# Altium schematic sheet Integrators.SchDoc: FIT_PM12 board
size 420 x 297 mm; CheckedBy: G.Kasprowicz; Author: INR Moscow; CompanyName: WUT ISE; DrawnBy: M.Podgórski; Organization: WUT ISE; Address1: PW ISE; Address2: Nowowiejska 15/19 00-665 Warsaw; Address3: gkasprow@gmail.com; DocumentNumber: 3; Revision: 2; SheetNumber: 5; SheetTotal: 21; ModifiedBy: -; CheckedDate: -; Title2: Integrators; DivGrp: WUT ISE; Designer: INR RAS; ModifiedDate: -; ProjectName: Sensor Box
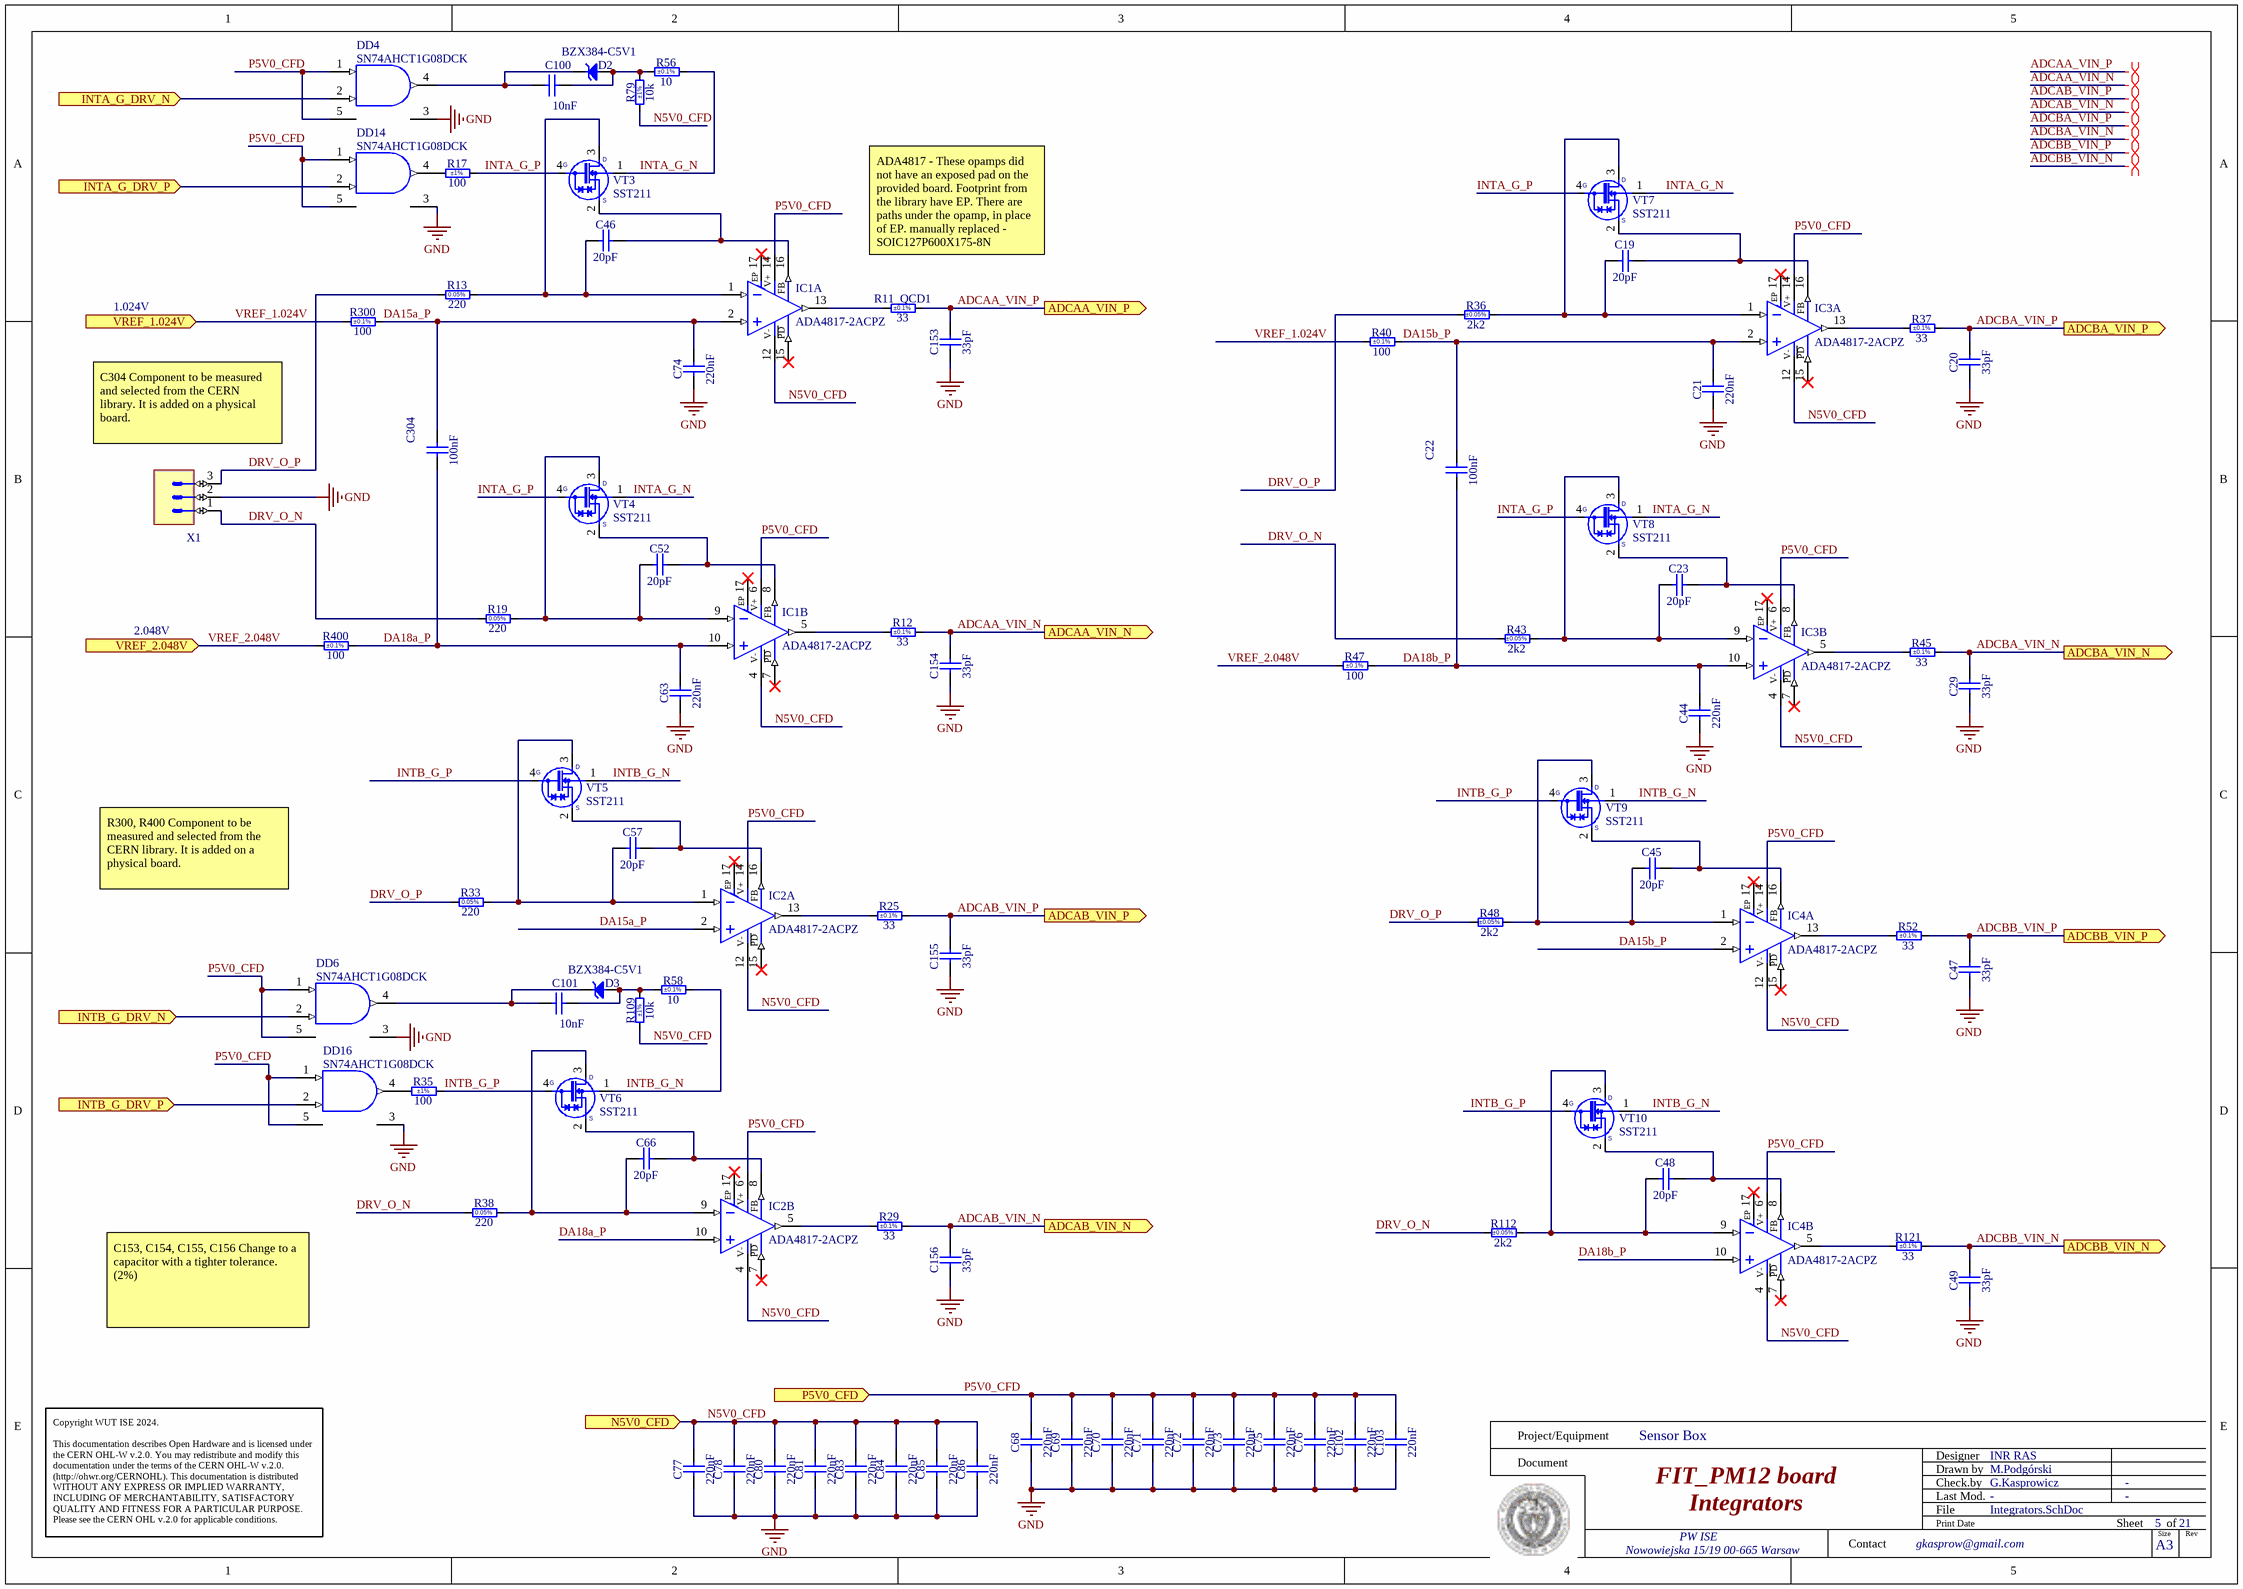
[diagram p0: Integrators.SchDoc]

## Parts
C19  20pF  [CAPC2012X135N]
C20  33pF  [CAPC1608X87N]
C21  220nF  [CAPC1005X55N]
C22  100nF  [CAPC2012X88N]
C23  20pF  [CAPC2012X135N]
C29  33pF  [CAPC1608X87N]
C44  220nF  [CAPC1005X55N]
C45  20pF  [CAPC2012X135N]
C46  20pF  [CAPC2012X135N]
C47  33pF  [CAPC1608X87N]
C48  20pF  [CAPC2012X135N]
C49  33pF  [CAPC1608X87N]
C52  20pF  [CAPC2012X135N]
C57  20pF  [CAPC2012X135N]
C63  220nF  [CAPC1005X55N]
C66  20pF  [CAPC2012X135N]
C68  220nF  [CAPC1005X55N]
C69  220nF  [CAPC1005X55N]
C70  220nF  [CAPC1005X55N]
C71  220nF  [CAPC1005X55N]
C72  220nF  [CAPC1005X55N]
C73  220nF  [CAPC1005X55N]
C74  220nF  [CAPC1005X55N]
C75  220nF  [CAPC1005X55N]
C76  220nF  [CAPC1005X55N]
C77  220nF  [CAPC1005X55N]
C78  220nF  [CAPC1005X55N]
C80  220nF  [CAPC1005X55N]
C81  220nF  [CAPC1005X55N]
C83  220nF  [CAPC1005X55N]
C84  220nF  [CAPC1005X55N]
C85  220nF  [CAPC1005X55N]
C86  220nF  [CAPC1005X55N]
C100  10nF  [CAPC1005X55N]
C101  10nF  [CAPC1005X55N]
C102  220nF  [CAPC1005X55N]
C103  220nF  [CAPC1005X55N]
C153  33pF  [CAPC1608X87N]
C154  33pF  [CAPC1608X87N]
C155  33pF  [CAPC1608X87N]
C156  33pF  [CAPC1608X87N]
C304  100nF  [CAPC2012X88N]
D2  BZX384-C5V1  [SOD2512X110N]
D3  BZX384-C5V1  [SOD2512X110N]
DD4  SN74AHCT1G08DCK  [SOT65P210X110-5N]
DD6  SN74AHCT1G08DCK  [SOT65P210X110-5N]
DD14  SN74AHCT1G08DCK  [SOT65P210X110-5N]
DD16  SN74AHCT1G08DCK  [SOT65P210X110-5N]
IC1  ADA4817-2ACPZ  [QFN65P400X400X80-17N-S240]  (parts A,B of 2)
IC2  ADA4817-2ACPZ  [QFN65P400X400X80-17N-S240]  (parts A,B of 2)
IC3  ADA4817-2ACPZ  [QFN65P400X400X80-17N-S240]  (parts A,B of 2)
IC4  ADA4817-2ACPZ  [QFN65P400X400X80-17N-S240]  (parts A,B of 2)
R11_QCD1  33  Tolerance: ±0.1%  [RESC1608X64N]
R12  33  Tolerance: ±0.1%  [RESC1608X64N]
R13  220  [RESC2012X60N]
R17  100  Tolerance: ±1%  [RESC1608X55N]
R19  220  [RESC2012X60N]
R25  33  Tolerance: ±0.1%  [RESC1608X64N]
R29  33  Tolerance: ±0.1%  [RESC1608X64N]
R33  220  [RESC2012X60N]
R35  100  Tolerance: ±1%  [RESC1608X55N]
R36  2k2  Tolerance: ±0.05%  [RESC2012X60N]
R37  33  Tolerance: ±0.1%  [RESC1608X64N]
R38  220  [RESC2012X60N]
R40  100  Tolerance: ±0.1%  [RES_VISHAY_FCHP0402]
R43  2k2  Tolerance: ±0.05%  [RESC2012X60N]
R45  33  Tolerance: ±0.1%  [RESC1608X64N]
R47  100  Tolerance: ±0.1%  [RES_VISHAY_FCHP0402]
R48  2k2  Tolerance: ±0.05%  [RESC2012X60N]
R52  33  Tolerance: ±0.1%  [RESC1608X64N]
R56  10  Tolerance: ±0.1%  [RESC2012X60N]
R58  10  Tolerance: ±0.1%  [RESC2012X60N]
R79  10k  Tolerance: ±1%  [RESC1608X55N]
R109  10k  Tolerance: ±1%  [RESC1608X55N]
R112  2k2  Tolerance: ±0.05%  [RESC2012X60N]
R121  33  Tolerance: ±0.1%  [RESC1608X64N]
R300  100  Tolerance: ±0.1%  [RES_VISHAY_FCHP0402]
R400  100  Tolerance: ±0.1%  [RES_VISHAY_FCHP0402]
VT3  SST211  [SOT143N]
VT4  SST211  [SOT143N]
VT5  SST211  [SOT143N]
VT6  SST211  [SOT143N]
VT7  SST211  [SOT143N]
VT8  SST211  [SOT143N]
VT9  SST211  [SOT143N]
VT10  SST211  [SOT143N]
X1  Header 3  [SAMTEC_DW-03-09-L-S-470]  (value not drawn)

## Ports
ADCAA_VIN_N (out), ADCAA_VIN_P (out), ADCAB_VIN_N (out), ADCAB_VIN_P (out), ADCBA_VIN_N (out), ADCBA_VIN_P (out), ADCBB_VIN_N (out), ADCBB_VIN_P (out), INTA_G_DRV_N (in), INTA_G_DRV_P (in), INTB_G_DRV_N (in), INTB_G_DRV_P (in), N5V0_CFD (in), P5V0_CFD (in), VREF_1.024V (in), VREF_2.048V (in)

## Nets
GND: C20.1 C21.1 C29.1 C44.1 C47.1 C49.1 C63.1 C68.1 C69.1 C70.1 C71.1 C72.1 C73.1 C74.1 C75.1 C76.1 C77.1 C78.1 C80.1 C81.1 C83.1 C84.1 C85.1 C86.1 C102.1 C103.1 C153.1 C154.1 C155.1 C156.1 DD4.3(GND) DD6.3(GND) DD14.3(GND) DD16.3(GND) X1.2
ADCAA_VIN_N: C154.2 R12.2 ; port ADCAA_VIN_N
ADCAA_VIN_P: C153.2 R11_QCD1.2 ; port ADCAA_VIN_P
ADCAB_VIN_N: C156.2 R29.2 ; port ADCAB_VIN_N
ADCAB_VIN_P: C155.2 R25.2 ; port ADCAB_VIN_P
ADCBA_VIN_N: C29.2 R45.2 ; port ADCBA_VIN_N
ADCBA_VIN_P: C20.2 R37.2 ; port ADCBA_VIN_P
ADCBB_VIN_N: C49.2 R121.2 ; port ADCBB_VIN_N
ADCBB_VIN_P: C47.2 R52.2 ; port ADCBB_VIN_P
DA15a_P: C74.2 C304.2 IC1.2(IN+) IC2.2(IN+) R300.1
DA15b_P: C21.2 C22.2 IC3.2(IN+) IC4.2(IN+) R40.1
DA18a_P: C63.2 C304.1 IC1.10(IN+) IC2.10(IN+) R400.1
DA18b_P: C22.1 C44.2 IC3.10(IN+) IC4.10(IN+) R47.1
DRV_O_N: R19.1 R38.1 R43.1 R112.1 X1.1
DRV_O_P: R13.1 R33.1 R36.1 R48.1 X1.3
INTA_G_DRV_N: DD4.2(A) ; port INTA_G_DRV_N
INTA_G_DRV_P: DD14.2(A) ; port INTA_G_DRV_P
INTA_G_N: R56.1 VT3.1(SUB) VT4.1(SUB) VT7.1(SUB) VT8.1(SUB)
INTA_G_P: R17.2 VT3.4(G) VT4.4(G) VT7.4(G) VT8.4(G)
INTB_G_DRV_N: DD6.2(A) ; port INTB_G_DRV_N
INTB_G_DRV_P: DD16.2(A) ; port INTB_G_DRV_P
INTB_G_N: R58.1 VT5.1(SUB) VT6.1(SUB) VT9.1(SUB) VT10.1(SUB)
INTB_G_P: R35.2 VT5.4(G) VT6.4(G) VT9.4(G) VT10.4(G)
N5V0_CFD: C77.2 C78.2 C80.2 C81.2 C83.2 C84.2 C85.2 C86.2 IC1.4(-Vs) IC1.12(-Vs) IC2.4(-Vs) IC2.12(-Vs) IC3.4(-Vs) IC3.12(-Vs) IC4.4(-Vs) IC4.12(-Vs) R79.1 R109.1 ; port N5V0_CFD
P5V0_CFD: C68.2 C69.2 C70.2 C71.2 C72.2 C73.2 C75.2 C76.2 C102.2 C103.2 DD4.1(B) DD4.5(VCC) DD6.1(B) DD6.5(VCC) DD14.1(B) DD14.5(VCC) DD16.1(B) DD16.5(VCC) IC1.6(+Vs) IC1.14(+Vs) IC2.6(+Vs) IC2.14(+Vs) IC3.6(+Vs) IC3.14(+Vs) IC4.6(+Vs) IC4.14(+Vs) ; port P5V0_CFD
VREF_1.024V: R40.2 R300.2 ; port VREF_1.024V
VREF_2.048V: R47.2 R400.2 ; port VREF_2.048V
NetC19_1: C19.1 IC3.1(IN-) R36.2 VT7.3(D)
NetC19_2: C19.2 IC3.16(FB) VT7.2(S)
NetC23_1: C23.1 IC3.9(IN-) R43.2 VT8.3(D)
NetC23_2: C23.2 IC3.8(FB) VT8.2(S)
NetC45_1: C45.1 IC4.1(IN-) R48.2 VT9.3(D)
NetC45_2: C45.2 IC4.16(FB) VT9.2(S)
NetC46_1: C46.1 IC1.1(IN-) R13.2 VT3.3(D)
NetC46_2: C46.2 IC1.16(FB) VT3.2(S)
NetC48_1: C48.1 IC4.9(IN-) R112.2 VT10.3(D)
NetC48_2: C48.2 IC4.8(FB) VT10.2(S)
NetC52_1: C52.1 IC1.9(IN-) R19.2 VT4.3(D)
NetC52_2: C52.2 IC1.8(FB) VT4.2(S)
NetC57_1: C57.1 IC2.1(IN-) R33.2 VT5.3(D)
NetC57_2: C57.2 IC2.16(FB) VT5.2(S)
NetC66_1: C66.1 IC2.9(IN-) R38.2 VT6.3(D)
NetC66_2: C66.2 IC2.8(FB) VT6.2(S)
NetC100_1: C100.1 D2.2(A) R56.2 R79.2
NetC100_2: C100.2 D2.1(C) DD4.4(Y)
NetC101_1: C101.1 D3.2(A) R58.2 R109.2
NetC101_2: C101.2 D3.1(C) DD6.4(Y)
NetDD14_4: DD14.4(Y) R17.1
NetDD16_4: DD16.4(Y) R35.1
NetIC1_5: IC1.5(OUT) R12.1
NetIC1_13: IC1.13(OUT) R11_QCD1.1
NetIC2_5: IC2.5(OUT) R29.1
NetIC2_13: IC2.13(OUT) R25.1
NetIC3_5: IC3.5(OUT) R45.1
NetIC3_13: IC3.13(OUT) R37.1
NetIC4_5: IC4.5(OUT) R121.1
NetIC4_13: IC4.13(OUT) R52.1

Not connected (* = marked no-connect by the designer): IC1 7(~{PD})* 15(~{PD})* 17(EP)*; IC2 7(~{PD})* 15(~{PD})* 17(EP)*; IC3 7(~{PD})* 15(~{PD})* 17(EP)*; IC4 7(~{PD})* 15(~{PD})* 17(EP)*

## Layout directives
differential pair; differential pair class D100: ADCAA_VIN_N, ADCAA_VIN_P, ADCAB_VIN_N, ADCAB_VIN_P, ADCBA_VIN_N, ADCBA_VIN_P, ADCBB_VIN_N, ADCBB_VIN_P

## Notes on the sheet
- ADA4817 - These opamps did not have an exposed pad on the provided board. Footprint from the library have EP. There are paths under the opamp, in place of EP. manually replaced - SOIC127P600X175-8N
- 1.024V
- (near X1) C304 Component to be measured and selected from the CERN library. It is added on a physical board.
- 2.048V
- R300, R400 Component to be measured and selected from the CERN library. It is added on a physical board.
- C153, C154, C155, C156 Change to a capacitor with a tighter tolerance. (2%)
- Project/Equipment
- Document
- Designer
- Drawn by
- Check.by
- Copyright WUT ISE 2024.
  This documentation describes Open Hardware and is licensed under the CERN OHL-W v.2.0. You may redistribute and modify this documentation under the terms of the CERN OHL-W v.2.0. (http://ohwr.org/CERNOHL). This documentation is distributed WITHOUT ANY EXPRESS OR IMPLIED WARRANTY, INCLUDING OF MERCHANTABILITY, SATISFACTORY QUALITY AND FITNESS FOR A PARTICULAR PURPOSE. Please see the CERN OHL v.2.0 for applicable conditions.
- Contact
- File
- Last Mod.
- Print Date
- Sheet
- Size
- A3
- of
- Rev
- (in symbol ADA4817-2ACPZ, part A) V+; V-; PD
- (in symbol ADA4817-2ACPZ, part B) V+; V-; PD
- (in symbol R0805_220R_0.05%_0.125W_10PPM) 0.05%

## Library data of the parts
C19 C23 C45 C46 C48 C52 C57 C66 = CC0805_20PF_50V_2%_C0G: Non-polarised capacitor; Part Description: SMD Multilayer Chip Ceramic Capacitor; Manufacturer: GENERIC; Manufacturer1 Part Number: CC0805GRNPO9BN200; Voltage: 50V; TC: C0G/NP0; Tolerance: ±2%; Part Number: CC0805_20PF_50V_2%_C0G; Component Kind: Standard; Component Type: Standard; Pin Count: 2; Value: 20pF; Status: None; Manufacturer Part Number: CC0805_20PF_50V_2%_C0G; Case: 0805; Mounted: Yes; Socket: No; SMD: Yes; Sense: No; Manufacturer1 Example: YAGEO PHYCOMP; Manufacturer1 ComponentHeight: 1.45mm; HelpURL: \\cern.ch\dfs\Applications\Altium\Datasheets\CC0805_NP0_YAGEO.pdf; Author: CERN DEM HF; CreateDate: 07.05.2024; LatestRevisionDate: 07.05.2024
C20 C29 C47 C49 C153-C156 = CC0603_33PF_50V_5%_NP0: Non-polarised capacitor; Part Description: SMD Multilayer Chip Ceramic Capacitor; Manufacturer: GENERIC; Manufacturer1 Part Number: 223886715339; Voltage: 50V; TC: C0G/NP0; Tolerance: ±5%; Part Number: CC0603_33PF_50V_5%_NP0; Component Kind: Standard; Component Type: Standard; Pin Count: 2; Value: 33pF; Status: Preferred; Manufacturer Part Number: CC0603_33PF_50V_5%_NP0; Case: 0603; Mounted: Yes; Socket: No; SMD: Yes; Sense: No; Manufacturer1 Example: PHYCOMP; Manufacturer1 ComponentHeight: 0.87mm; HelpURL: \\cern.ch\dfs\Applications\Altium\Datasheets\CC0603_NP0_PHYCOMP.pdf; Author: CERN DEM JLC; CreateDate: 03.12.2007; LatestRevisionDate: 03.12.2007
C21 C44 C63 C68-C78 C80 C81 C83-C86 C102 C103 = CC0402_220NF_16V_10%_X7R: Non-polarised capacitor; Part Description: SMD Multilayer Chip Ceramic Capacitor; Manufacturer: GENERIC; Manufacturer1 Part Number: C1005X7R1C224K050; Voltage: 16V; TC: X7R; Tolerance: ±10%; Part Number: CC0402_220NF_16V_10%_X7R; Component Kind: Standard; Component Type: Standard; Pin Count: 2; Value: 220nF; Status: Preferred; Manufacturer Part Number: CC0402_220NF_16V_10%_X7R; Case: 0402; Mounted: Yes; Socket: No; SMD: Yes; Sense: No; Manufacturer1 Example: TDK; Manufacturer1 ComponentHeight: 0.55mm; HelpURL: \\cern.ch\dfs\Applications\Altium\Datasheets\CC0402_X7R_TDK_C.pdf; Author: CERN DEM JLC; CreateDate: 25.10.2012; LatestRevisionDate: 25.10.2012
C22 C304 = CC0805_100NF_50V_1%_NP0: Non-polarised capacitor; Part Description: SMD Multilayer Chip Ceramic Capacitor; Manufacturer: GENERIC; Manufacturer1 Part Number: 0805N103F500C; Voltage: 50V; TC: C0G/NP0; Tolerance: ±1%; Part Number: CC0805_100NF_50V_1%_NP0; Component Kind: Standard; Component Type: Standard; Footprint: CAPC2012X135N; Pin Count: 2; Value: 100nF; Status: Not Recommended; Manufacturer Part Number: CC0805_100NF_50V_1%_NP0; Case: 0805; Mounted: Yes; Socket: No; SMD: Yes; Sense: No; ComponentHeight: 1.35mm; Manufacturer1 Example: WALSIN TECHNOLOGY CORPORATION; Manufacturer1 ComponentHeight: 1.35mm; HelpURL: \\cern.ch\dfs\Applications\Altium\Datasheets\CC0805_WALSIN_0805.pdf; Author: CERN DEM HF; CreateDate: 28.08.2023; LatestRevisionDate: 28.08.2023
C100 C101 = CC0402_10NF_25V_10%_X7R: Non-polarised capacitor; Part Description: SMD Multilayer Chip Ceramic Capacitor; Manufacturer: GENERIC; Manufacturer1 Part Number: C1005X7R1E103K050; Voltage: 25V; TC: X7R; Tolerance: ±10%; Part Number: CC0402_10NF_25V_10%_X7R; Component Kind: Standard; Component Type: Standard; Pin Count: 2; Value: 10nF; Status: Preferred; Manufacturer Part Number: CC0402_10NF_25V_10%_X7R; Case: 0402; Mounted: Yes; Socket: No; SMD: Yes; Sense: No; Manufacturer1 Example: TDK; Manufacturer1 ComponentHeight: 0.55mm; HelpURL: \\cern.ch\dfs\Applications\Altium\Datasheets\CC0402_X7R_TDK_C.pdf; Author: CERN DEM JLC; CreateDate: 25.10.2012; LatestRevisionDate: 25.10.2012
D2 D3 = BZX384-C5V1: Zener Diode; Part Description: Zener Voltage Regulator; Manufacturer: NEXPERIA; Voltage: 5.1V; Power: 300mW; PressFit: No; Bonding: No; Part Number: BZX384-C5V1; Component Kind: Standard; Component Type: Standard; Device: BZX384-C5V1; PackageDescription: Small Outline Diode (SOD-323), 1.70mm W X 1.25mm L X 1.10mm H body,  IPC Medium Density; Manufacturer Part Number: BZX384-C5V1; Pin Count: 2; Case: SOD-323; Mounted: Yes; Socket: No; SMD: Yes; Sense: No; ComponentHeight: 1.1mm; HelpURL: \\cern.ch\dfs\Applications\Altium\Datasheets\BZX384.pdf; Author: CERN DEM MR; CreateDate: 24.07.2018; LatestRevisionDate: 24.07.2018
DD4 DD6 DD14 DD16 = SN74AHCT1G08DCK: Single 2-Input AND Gate; Part Description: Single 2-Input Positive-AND Gate; Manufacturer: TEXAS INSTRUMENTS; PressFit: No; Bonding: No; Part Number: SN74AHCT1G08DCK; Component Kind: Standard; Component Type: Standard; Device: SN74AHCT1G08DCK; PackageDescription: SOT353, SC70-5, 0.65mm Pitch; 5 Pin, 1.25mm W X 2.00mm L X 1.10mm H body, IPC Medium Density; Manufacturer Part Number: SN74AHCT1G08DCK; Pin Count: 5; Case: SOT353; Mounted: Yes; Socket: No; SMD: Yes; Sense: No; ComponentHeight: 1.1mm; Author: CERN DEM HF; HelpURL: \\cern.ch\dfs\Applications\Altium\Datasheets\NC7SZ08.pdf; CreateDate: 17.05.2024; LatestRevisionDate: 17.05.2024
IC1-IC4 = ADA4817-2ACPZ: Dual Low Noise, 1GHz FastFEET Operational Amplifier; Manufacturer: ANALOG DEVICES; PressFit: No; Bonding: No; Part Number: ADA4817-2ACPZ; Component Kind: Standard; Component Type: Standard; Device: ADA4817-2ACPZ; PackageDescription: QFN, 0.65mm Pitch, Square; 16 Pin, 4.00mm L X 4.00mm W X 0.80mm H body (w/Thermal Tab 2.40 X 2.40mm), IPC Medium Density; Part Description: Dual Low Noise, 1GHz FastFEET Operational Amplifier; Manufacturer Part Number: ADA4817-2ACP; Pin Count: 17; Case: QFN16; Mounted: Yes; Socket: No; SMD: Yes; Sense: No; ComponentHeight: 0.8mm; Author: CERN DEM BC; HelpURL: \\cern.ch\dfs\Applications\Altium\Datasheets\ADA4817-2ACPZ.pdf; CreateDate: 25.03.2020; LatestRevisionDate: 31.03.2022
R11_QCD1 R12 R25 R29 R37 R45 R52 R121 = R0603_33R_0.1%_0.1W_10PPM: Resistor - 0.1%; Part Description: Thin Film Chip Resistor; Manufacturer: GENERIC; Manufacturer1 Part Number: RT0603BRD0733RL; Power: 0.1W; TC: ±10ppm/°C; PressFit: No; Part Number: R0603_33R_0.1%_0.1W_10PPM; Component Kind: Standard; Component Type: Standard; Pin Count: 2; Value: 33; Status: Not Recommended; Manufacturer Part Number: R0603_33R_0.1%_0.1W_10PPM; Case: 0603; Mounted: Yes; Sense: No; Socket: No; SMD: Yes; Manufacturer1 Example: YAGEO; Manufacturer1 ComponentHeight: 0.55mm; HelpURL: \\cern.ch\dfs\Applications\Altium\Datasheets\R0603_YAGEO_RT.pdf; Author: CERN DEM HF; CreateDate: 17.05.2024; LatestRevisionDate: 17.05.2024
R13 R19 R33 R38 = R0805_220R_0.05%_0.125W_10PPM: Resistor - 0.05%; Part Description: Thin Film Chip Resistor; Manufacturer: GENERIC; Manufacturer1 Part Number: RG2012N-221-W-T1; Power: 0.125W; TC: ±10ppm/°C; PressFit: No; Part Number: R0805_220R_0.05%_0.125W_10PPM; Component Kind: Standard; Component Type: Standard; Pin Count: 2; Value: 220; Status: Not Recommended; Tolerance: ±0.05%; Manufacturer Part Number: R0805_220R_0.05%_0.125W_10PPM; Case: 0805; Mounted: Yes; Sense: No; Socket: No; SMD: Yes; Manufacturer1 Example: SUSUMU; Manufacturer1 ComponentHeight: 0.5mm; HelpURL: \\cern.ch\dfs\Applications\Altium\Datasheets\R0805_SUSUMU_RG.pdf; Author: CERN DEM HF; CreateDate: 17.05.2024; LatestRevisionDate: 17.05.2024
R17 R35 = R0603_100R_1%_0.1W_100PPM: Resistor - 1%; Part Description: General Purpose Thick Film Chip Resistor; Manufacturer: GENERIC; Manufacturer1 Part Number: NRC06F4700TRF; Power: 0.1W; TC: ±100ppm/°C; PressFit: No; Part Number: R0603_100R_1%_0.1W_100PPM; Component Kind: Standard; Component Type: Standard; Pin Count: 2; Value: 100; Status: Preferred; Manufacturer Part Number: R0603_100R_1%_0.1W_100PPM; Case: 0603; Mounted: Yes; Sense: No; Socket: No; SMD: Yes; Manufacturer1 Example: NIC COMPONENT; Manufacturer1 ComponentHeight: 0.55mm; HelpURL: \\cern.ch\dfs\Applications\Altium\Datasheets\R0603_NIC_NRC.pdf; Author: CERN DEM JLC; CreateDate: 03.12.2007; LatestRevisionDate: 13.03.2008
R36 R43 R48 R112 = R0805_2K2_1%_0.125W_100PPM: Resistor - 0.05%; Part Number: R0805_2K2_0.05%_0.125W_100PPM; Part Description: General Purpose Thick Film Chip Resistor; Manufacturer: GENERIC; Manufacturer1 Part Number: ERA-6ARW222V; Power: 0.125W; TC: ±100ppm/°C; PressFit: No; Component Kind: Standard; Component Type: Standard; Pin Count: 2; Value: 2k2; Status: Preferred; Manufacturer Part Number: R0805_2K2_0.05%_0.125W_100PPM; Case: 0805; Mounted: Yes; Sense: No; Socket: No; SMD: Yes; Manufacturer1 Example: Panasonic; Manufacturer1 ComponentHeight: 0.6mm; HelpURL: \\cern.ch\dfs\Applications\Altium\Datasheets\R0805_NIC_NRC.pdf; Author: CERN DEM JLC; CreateDate: 03.12.2007; LatestRevisionDate: 13.03.2008
R40 R47 R300 R400 = R0402_100R_0.1%_1W_25PPM_VISHAY_FCHP0402E1000BS: Resistor - 0.1%; Part Description: High Frequency 60 GHz High Power 1 W Thin Film Surface Mount Chip Resistor; Manufacturer: VISHAY; Power: 1W; TC: ±25ppm/°C; PressFit: No; Part Number: R0402_100R_0.1%_1W_25PPM_VISHAY_FCHP0402E1000BS; Component Kind: Standard; Component Type: Standard; Pin Count: 2; Value: 100; Status: Not Recommended; Manufacturer Part Number: FCHP0402E1000BS; Case: 0402; Mounted: Yes; Sense: No; Socket: No; SMD: Yes; ComponentHeight: 0.38mm; HelpURL: \\cern.ch\dfs\Applications\Altium\Datasheets\R0402_VISHAY_FCHP.pdf; Author: CERN DEM HF; CreateDate: 04.04.2023; LatestRevisionDate: 04.04.2023
R56 R58 = R0805_10R_0.1%_0.1W_10PPM: Resistor - 0.1%; Part Description: Thin Film Chip Resistor; Manufacturer: GENERIC; Manufacturer1 Part Number: RN73C2A10RBTG; Power: 0.1W; TC: ±10ppm; PressFit: No; Part Number: R0805_10R_0.1%_0.1W_10PPM; Component Kind: Standard; Component Type: Standard; Pin Count: 2; Value: 10; Status: Not Recommended; Manufacturer Part Number: R0805_10R_0.1%_0.1W_10PPM; Case: 0805; Mounted: Yes; Sense: No; Socket: No; SMD: Yes; Manufacturer1 Example: TYCO HOLSWORTHY; Manufacturer1 ComponentHeight: 0.6mm; HelpURL: \\cern.ch\dfs\Applications\Altium\Datasheets\R0805_Tyco_RN73.pdf; Author: CERN DEM JLC; CreateDate: 03.12.2007; LatestRevisionDate: 13.03.2008
R79 R109 = R0603_10K_1%_0.1W_100PPM: Resistor - 1%; Part Description: General Purpose Thick Film Chip Resistor; Manufacturer: GENERIC; Manufacturer1 Part Number: NRC06F1002TRF; Power: 0.1W; TC: ±100ppm/°C; PressFit: No; Part Number: R0603_10K_1%_0.1W_100PPM; Component Kind: Standard; Component Type: Standard; Pin Count: 2; Value: 10k; Status: Preferred; Manufacturer Part Number: R0603_10K_1%_0.1W_100PPM; Case: 0603; Mounted: Yes; Sense: No; Socket: No; SMD: Yes; Manufacturer1 Example: NIC COMPONENT; Manufacturer1 ComponentHeight: 0.55mm; HelpURL: \\cern.ch\dfs\Applications\Altium\Datasheets\R0603_NIC_NRC.pdf; Author: CERN DEM JLC; CreateDate: 03.12.2007; LatestRevisionDate: 13.03.2008
VT3-VT10 = SST211: 30V, 50 mA N-Channel Enhancement Switching Transistor; Part Description: 30V, 50mA, N-Channel Enhancement Switching Transistor; Manufacturer: Linear Systems; PressFit: No; Bonding: No; Part Number: SST211; Component Kind: Standard; Component Type: Standard; Device: SST211; PackageDescription: SOT143, 4-Leads, Body 3.0x2.6mm (max), Pitch 1.92mm, IPC Medium Density; Status: Obsolete; Manufacturer Part Number: SST211; Pin Count: 4; Case: SOT143; Mounted: Yes; Socket: No; SMD: Yes; Sense: No; ComponentHeight: 1.3mm; HelpURL: \\cern.ch\dfs\Applications\Altium\Datasheets\BSS83,215.pdf; Author: CERN DEM JLC; CreateDate: 01.07.2014; LatestRevisionDate: 17.05.2016
X1 = SAMTEC_DW-03-09-L-S-470: Connector 3 Male; Part Description: 3 Contacts, Pitch 2.54mm, Single Row Straight .Flex Stack, Flexible Board Stacker (Stacker Height = 11,938mm); Manufacturer: SAMTEC; PressFit: No; Part Number: SAMTEC_DW-03-09-L-S-470; Component Kind: Standard; Component Type: Standard; Pin Count: 3; Family: Header 3; Mounted: Yes; Socket: No; SMD: No; Sense: No; Status: None; Manufacturer Part Number: DW-03-09-L-S-470; ComponentHeight: 15.75mm; HelpURL: \\cern.ch\dfs\Applications\Altium\Datasheets\SAMTEC_DW.pdf; Author: CERN DEM HF; CreateDate: 06.06.2024; LatestRevisionDate: 06.06.2024